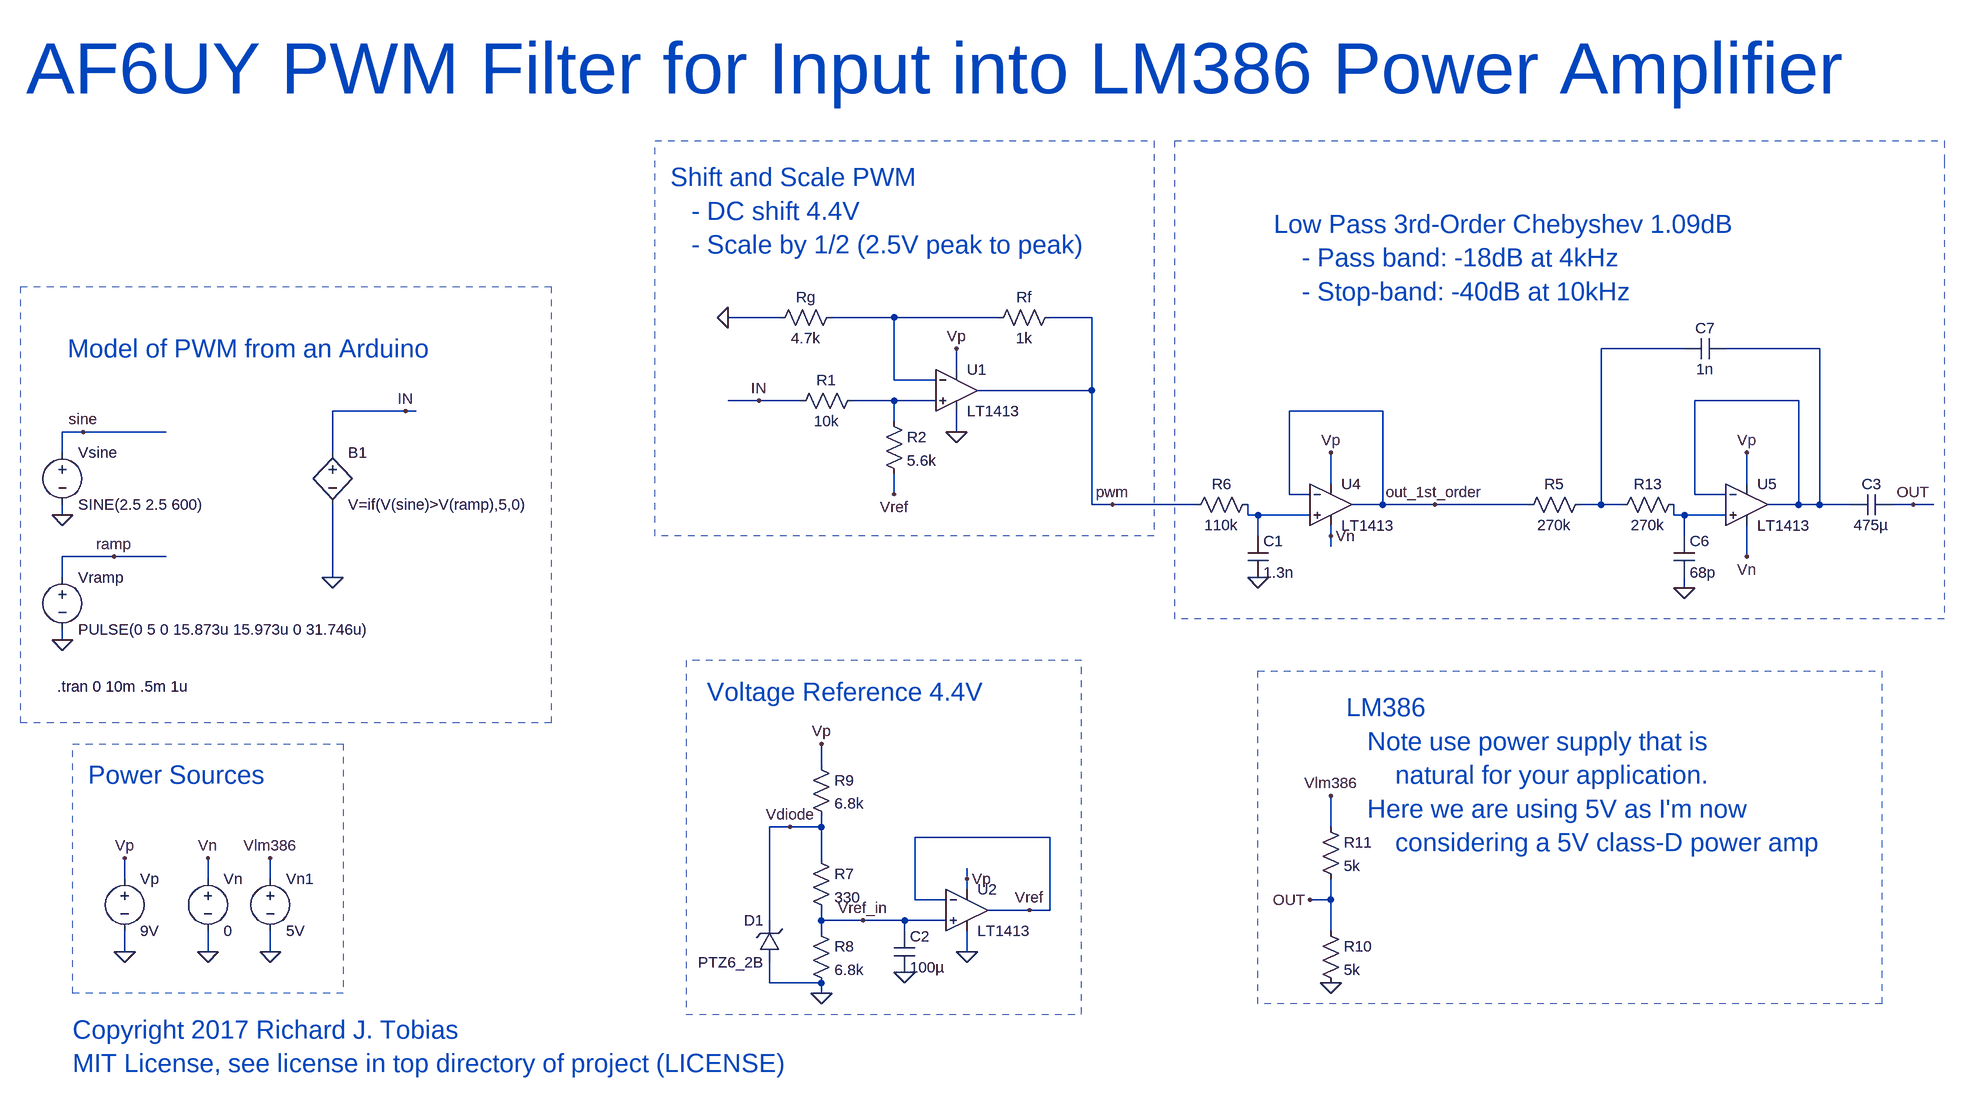
[diagram p0: schematic TransientAnalysis.asc]
TransientAnalysis.asc, the LTspice schematic file:
Version 4
SHEET 1 5196 1184
WIRE -32 -80 -112 -80
WIRE 144 -80 48 -80
WIRE 304 -80 144 -80
WIRE 448 -80 384 -80
WIRE 1360 -32 1232 -32
WIRE 1568 -32 1424 -32
WIRE 240 0 240 -32
WIRE 144 16 144 -80
WIRE 208 16 144 16
WIRE 448 32 448 -80
WIRE 448 32 272 32
WIRE -64 48 -112 48
WIRE 0 48 -64 48
WIRE 144 48 80 48
WIRE 208 48 144 48
WIRE 1536 48 1376 48
WIRE -608 64 -720 64
WIRE -592 64 -608 64
WIRE 896 64 752 64
WIRE 144 80 144 48
WIRE -1104 96 -1136 96
WIRE -976 96 -1104 96
WIRE 240 96 240 64
WIRE -1136 128 -1136 96
WIRE -720 128 -720 64
WIRE 816 176 816 128
WIRE 1456 176 1456 128
WIRE 144 192 144 160
WIRE 752 192 752 64
WIRE 784 192 752 192
WIRE 1376 192 1376 48
WIRE 1424 192 1376 192
WIRE 448 208 448 32
WIRE 480 208 448 208
WIRE 608 208 480 208
WIRE 896 208 896 64
WIRE 896 208 848 208
WIRE 976 208 896 208
WIRE 1120 208 976 208
WIRE 1232 208 1232 -32
WIRE 1232 208 1200 208
WIRE 1264 208 1232 208
WIRE 1536 208 1536 48
WIRE 1536 208 1488 208
WIRE 1568 208 1568 -32
WIRE 1568 208 1536 208
WIRE 1616 208 1568 208
WIRE 1712 208 1680 208
WIRE 1744 208 1712 208
WIRE -1136 224 -1136 208
WIRE 688 224 688 208
WIRE 704 224 688 224
WIRE 784 224 704 224
WIRE 1344 224 1344 208
WIRE 1360 224 1344 224
WIRE 1424 224 1360 224
WIRE 704 256 704 224
WIRE 816 256 816 240
WIRE 1360 256 1360 224
WIRE 816 272 816 256
WIRE -1056 288 -1136 288
WIRE -976 288 -1056 288
WIRE 1456 288 1456 240
WIRE -1136 320 -1136 288
WIRE -720 320 -720 208
WIRE 1360 336 1360 320
WIRE -1136 416 -1136 400
WIRE 32 608 32 576
WIRE -16 704 -48 704
WIRE 32 704 32 688
WIRE 32 704 -16 704
WIRE 816 704 816 656
WIRE 384 720 176 720
WIRE 32 752 32 704
WIRE -1040 784 -1040 752
WIRE -912 784 -912 752
WIRE -816 784 -816 752
WIRE 256 784 256 768
WIRE 256 800 256 784
WIRE 176 816 176 720
WIRE 224 816 176 816
WIRE 816 816 816 784
WIRE 816 816 784 816
WIRE 352 832 288 832
WIRE 384 832 384 720
WIRE 384 832 352 832
WIRE -48 848 -48 704
WIRE 32 848 32 832
WIRE 96 848 32 848
WIRE 160 848 96 848
WIRE 224 848 160 848
WIRE 32 864 32 848
WIRE 160 864 160 848
WIRE 816 864 816 816
WIRE -1040 896 -1040 864
WIRE -912 896 -912 864
WIRE -816 896 -816 864
WIRE 256 896 256 864
WIRE -48 944 -48 912
WIRE 32 944 -48 944
WIRE 32 960 32 944
FLAG -720 320 0
FLAG -1040 896 0
FLAG -912 896 0
FLAG -1040 752 Vp
FLAG -912 752 Vn
FLAG 816 128 Vp
FLAG 816 256 Vn
FLAG 976 208 out_1st_order
FLAG -64 48 IN
FLAG 1712 208 OUT
FLAG 1456 128 Vp
FLAG 1456 288 Vn
FLAG -1136 224 0
FLAG -1136 416 0
FLAG -1104 96 sine
FLAG -1056 288 ramp
FLAG 704 320 0
FLAG 1360 336 0
FLAG 240 -32 Vp
FLAG 240 96 0
FLAG -112 -80 0
FLAG 144 192 Vref
FLAG 480 208 pwm
FLAG 256 896 0
FLAG 352 832 Vref
FLAG 32 576 Vp
FLAG 32 960 0
FLAG -16 704 Vdiode
FLAG 256 784 Vp
FLAG -608 64 IN
FLAG 160 928 0
FLAG 96 848 Vref_in
FLAG 816 944 0
FLAG 784 816 OUT
FLAG 816 656 Vlm386
FLAG -816 896 0
FLAG -816 752 Vlm386
SYMBOL voltage -1040 768 R0
WINDOW 123 0 0 Left 2
WINDOW 39 0 0 Left 2
SYMATTR InstName Vp
SYMATTR Value 9V
SYMBOL voltage -912 768 R0
WINDOW 123 0 0 Left 2
WINDOW 39 0 0 Left 2
SYMATTR InstName Vn
SYMATTR Value 0
SYMBOL voltage -1136 112 R0
SYMATTR InstName Vsine
SYMATTR Value SINE(2.5 2.5 600)
SYMBOL voltage -1136 304 R0
SYMATTR InstName Vramp
SYMATTR Value PULSE(0 5 0 15.873u 15.973u 0 31.746u)
SYMBOL bv -720 112 R0
SYMATTR InstName B1
SYMATTR Value V=if(V(sine)>V(ramp),5,0)
SYMBOL res 128 64 R0
SYMATTR InstName R2
SYMATTR Value 5.6k
SYMBOL res 96 32 R90
WINDOW 0 0 56 VBottom 2
WINDOW 3 32 56 VTop 2
SYMATTR InstName R1
SYMATTR Value 10k
SYMBOL res 64 -96 R90
WINDOW 0 0 56 VBottom 2
WINDOW 3 32 56 VTop 2
SYMATTR InstName Rg
SYMATTR Value 4.7k
SYMBOL res 400 -96 R90
WINDOW 0 0 56 VBottom 2
WINDOW 3 32 56 VTop 2
SYMATTR InstName Rf
SYMATTR Value 1k
SYMBOL Opamps/LT1413 816 144 R0
SYMATTR InstName U4
SYMBOL Opamps/LT1413 1456 144 R0
SYMATTR InstName U5
SYMBOL res 704 192 R90
WINDOW 0 0 56 VBottom 2
WINDOW 3 32 56 VTop 2
SYMATTR InstName R6
SYMATTR Value 110k
SYMBOL res 1360 192 R90
WINDOW 0 0 56 VBottom 2
WINDOW 3 32 56 VTop 2
SYMATTR InstName R13
SYMATTR Value 270k
SYMBOL res 1216 192 R90
WINDOW 0 0 56 VBottom 2
WINDOW 3 32 56 VTop 2
SYMATTR InstName R5
SYMATTR Value 270k
SYMBOL cap 688 256 R0
SYMATTR InstName C1
SYMATTR Value 1.3n
SYMBOL cap 1344 256 R0
SYMATTR InstName C6
SYMATTR Value 68p
SYMBOL cap 1424 -48 R90
WINDOW 0 0 32 VBottom 2
WINDOW 3 32 32 VTop 2
SYMATTR InstName C7
SYMATTR Value 1n
SYMBOL Opamps/LT1413 240 -32 R0
SYMATTR InstName U1
SYMBOL Opamps/LT1413 256 768 R0
SYMATTR InstName U2
SYMBOL res 16 736 R0
SYMATTR InstName R7
SYMATTR Value 330
SYMBOL res 16 848 R0
SYMATTR InstName R8
SYMATTR Value 6.8k
SYMBOL zener -32 912 R180
WINDOW 0 24 64 Left 2
WINDOW 3 24 0 Left 2
SYMATTR InstName D1
SYMATTR Value PTZ6_2B
SYMBOL res 16 592 R0
SYMATTR InstName R9
SYMATTR Value 6.8k
SYMBOL cap 144 864 R0
SYMATTR InstName C2
SYMATTR Value 100µ
SYMBOL cap 1680 192 R90
WINDOW 0 0 32 VBottom 2
WINDOW 3 32 32 VTop 2
SYMATTR InstName C3
SYMATTR Value 475µ
SYMBOL res 800 848 R0
SYMATTR InstName R10
SYMATTR Value 5k
SYMBOL res 800 688 R0
SYMATTR InstName R11
SYMATTR Value 5k
SYMBOL voltage -816 768 R0
WINDOW 123 0 0 Left 2
WINDOW 39 0 0 Left 2
SYMATTR InstName Vn1
SYMATTR Value 5V
TEXT -1144 488 Left 2 !.tran 0 10m .5m 1u
TEXT -1128 -32 Left 4 ;Model of PWM from an Arduino
TEXT -200 -296 Left 4 ;Shift and Scale PWM\n   - DC shift 4.4V\n   - Scale by 1/2 (2.5V peak to peak)
TEXT -144 496 Left 4 ;Voltage Reference 4.4V
TEXT 728 -224 Left 4 ;Low Pass 3rd-Order Chebyshev 1.09dB\n    - Pass band: -18dB at 4kHz\n    - Stop-band: -40dB at 10kHz
TEXT -1192 -464 Left 7 ;AF6UY PWM Filter for Input into LM386 Power Amplifier
TEXT -1096 624 Left 4 ;Power Sources
TEXT 840 520 Left 4 ;LM386\n   Note use power supply that is \n       natural for your application.\n   Here we are using 5V as I'm now \n       considering a 5V class-D power amp
TEXT -1120 1016 Left 4 ;Copyright 2017 Richard J. Tobias\nMIT License, see license in top directory of project (LICENSE)
LINE Normal -1200 544 -1200 -128 2
LINE Normal -384 544 -1200 544 2
LINE Normal -384 -128 -384 544 2
LINE Normal -1200 -128 -384 -128 2
LINE Normal -1200 -128 -1200 -128 2
LINE Normal -176 448 -176 992 2
LINE Normal 432 448 -176 448 2
LINE Normal 432 992 432 448 2
LINE Normal -176 992 432 992 2
LINE Normal -176 992 -176 992 2
LINE Normal -1120 960 -1120 576 2
LINE Normal -704 960 -1120 960 2
LINE Normal -704 576 -704 960 2
LINE Normal -1120 576 -704 576 2
LINE Normal -1120 576 -1120 576 2
LINE Normal 544 -352 544 256 2
LINE Normal -224 -352 544 -352 2
LINE Normal -224 256 -224 -352 2
LINE Normal 544 256 -224 256 2
LINE Normal 544 256 544 256 2
LINE Normal 576 384 576 -352 2
LINE Normal 1760 384 576 384 2
LINE Normal 576 -352 576 -352 2
LINE Normal 704 976 704 464 2
LINE Normal 1664 976 704 976 2
LINE Normal 1664 464 1664 976 2
LINE Normal 704 464 1664 464 2
LINE Normal 704 464 704 464 2
LINE Normal 1760 -320 1760 384 2
LINE Normal 1760 -352 1760 -320 2
LINE Normal 576 -352 1760 -352 2
LINE Normal 576 -352 576 -352 2

The netlist it stands for:
* TransientAnalysis.asc
Vp Vp 0 9V
Vn Vn 0 0
Vsine sine 0 SINE(2.5 2.5 600)
Vramp ramp 0 PULSE(0 5 0 15.873u 15.973u 0 31.746u)
B1 IN 0 V=if(V(sine)>V(ramp),5,0)
R2 N004 Vref 5.6k
R1 N004 IN 10k
Rg N001 0 4.7k
Rf pwm N001 1k
XU4 N005 out_1st_order Vp Vn out_1st_order LT1413  ; pins In+ In- V+ V- OUT
XU5 N006 N003 Vp Vn N003 LT1413  ; pins In+ In- V+ V- OUT
R6 N005 pwm 110k
R13 N006 N002 270k
R5 N002 out_1st_order 270k
C1 N005 0 1.3n
C6 N006 0 68p
C7 N003 N002 1n
XU1 N004 N001 Vp 0 pwm LT1413  ; pins In+ In- V+ V- OUT
XU2 Vref_in Vref Vp 0 Vref LT1413  ; pins In+ In- V+ V- OUT
R7 Vdiode Vref_in 330
R8 Vref_in 0 6.8k
D1 0 Vdiode PTZ6_2B
R9 Vp Vdiode 6.8k
C2 Vref_in 0 100µ
C3 OUT N003 475µ
R10 OUT 0 5k
R11 Vlm386 OUT 5k
Vn1 Vlm386 0 5V
.model D D
.lib standard.dio
.tran 0 10m .5m 1u
* Model of PWM from an Arduino
* Shift and Scale PWM
*    - DC shift 4.4V
*    - Scale by 1/2 (2.5V peak to peak)
* Voltage Reference 4.4V
* Low Pass 3rd-Order Chebyshev 1.09dB
*     - Pass band: -18dB at 4kHz
*     - Stop-band: -40dB at 10kHz
* AF6UY PWM Filter for Input into LM386 Power Amplifier
* Power Sources
* LM386
*    Note use power supply that is
*        natural for your application.
*    Here we are using 5V as I'm now
*        considering a 5V class-D power amp
* Copyright 2017 Richard J. Tobias
* MIT License, see license in top directory of project (LICENSE)
.lib LTC.lib
.backanno
.end